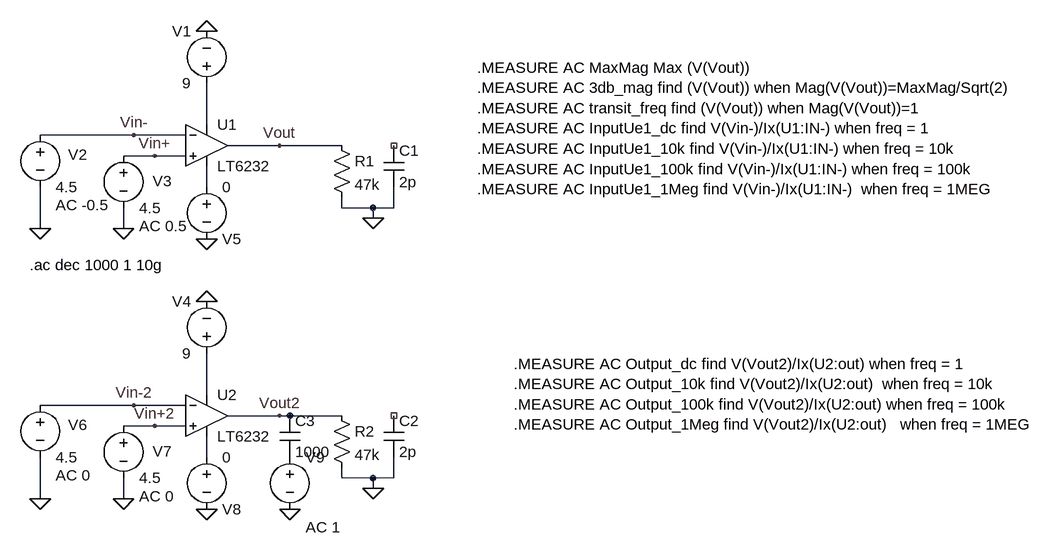
[diagram p0: schematic OpAmpTestBench.asc]
OpAmpTestBench.asc, the LTspice schematic file:
Version 4
SHEET 1 1624 796
WIRE 208 160 208 96
WIRE 96 176 -48 176
WIRE 176 176 96 176
WIRE 320 192 240 192
WIRE 416 192 320 192
WIRE 128 208 80 208
WIRE 176 208 128 208
WIRE 208 256 208 224
WIRE 416 288 416 272
WIRE 464 288 416 288
WIRE 496 288 496 256
WIRE 496 288 464 288
WIRE 464 304 464 288
WIRE -48 320 -48 256
WIRE 80 320 80 288
WIRE 208 576 208 512
WIRE 96 592 -48 592
WIRE 176 592 96 592
WIRE 320 608 240 608
WIRE 336 608 320 608
WIRE 416 608 336 608
WIRE 128 624 80 624
WIRE 176 624 128 624
WIRE 208 672 208 640
WIRE 416 704 416 688
WIRE 464 704 416 704
WIRE 496 704 496 672
WIRE 496 704 464 704
WIRE 464 720 464 704
WIRE -48 736 -48 672
WIRE 80 736 80 704
FLAG 208 16 0
FLAG 464 304 0
FLAG 80 320 0
FLAG -48 320 0
FLAG 96 176 Vin-
FLAG 128 208 Vin+
FLAG 320 192 Vout
FLAG 208 336 0
FLAG 208 432 0
FLAG 464 720 0
FLAG 80 736 0
FLAG -48 736 0
FLAG 96 592 Vin-2
FLAG 128 624 Vin+2
FLAG 320 608 Vout2
FLAG 208 752 0
FLAG 336 752 0
SYMBOL Opamps\\LT6232 208 192 R0
SYMATTR InstName U1
SYMBOL voltage 208 112 R180
WINDOW 0 24 96 Left 2
WINDOW 3 24 16 Left 2
WINDOW 123 0 0 Left 2
WINDOW 39 0 0 Left 2
SYMATTR InstName V1
SYMATTR Value 9
SYMBOL res 400 176 R0
SYMATTR InstName R1
SYMATTR Value 47k
SYMBOL cap 480 192 R0
SYMATTR InstName C1
SYMATTR Value 2p
SYMBOL voltage -48 160 R0
WINDOW 0 43 46 Left 2
WINDOW 123 24 124 Left 2
WINDOW 39 24 152 Left 2
SYMATTR InstName V2
SYMATTR Value2 AC -0.5
SYMATTR Value 4.5
SYMBOL voltage 80 192 R0
WINDOW 0 45 55 Left 2
WINDOW 123 24 124 Left 2
WINDOW 39 24 152 Left 2
SYMATTR InstName V3
SYMATTR Value2 AC 0.5
SYMATTR Value 4.5
SYMBOL voltage 208 240 R0
WINDOW 0 24 96 Left 2
WINDOW 3 24 16 Left 2
WINDOW 123 0 0 Left 2
WINDOW 39 0 0 Left 2
SYMATTR InstName V5
SYMATTR Value 0
SYMBOL Opamps\\LT6232 208 608 R0
SYMATTR InstName U2
SYMBOL voltage 208 528 R180
WINDOW 0 24 96 Left 2
WINDOW 3 24 16 Left 2
WINDOW 123 0 0 Left 2
WINDOW 39 0 0 Left 2
SYMATTR InstName V4
SYMATTR Value 9
SYMBOL res 400 592 R0
SYMATTR InstName R2
SYMATTR Value 47k
SYMBOL cap 480 608 R0
SYMATTR InstName C2
SYMATTR Value 2p
SYMBOL voltage -48 576 R0
WINDOW 0 43 46 Left 2
WINDOW 123 24 124 Left 2
WINDOW 39 24 152 Left 2
SYMATTR InstName V6
SYMATTR Value2 AC 0
SYMATTR Value 4.5
SYMBOL voltage 80 608 R0
WINDOW 0 45 55 Left 2
WINDOW 123 24 124 Left 2
WINDOW 39 24 152 Left 2
SYMATTR InstName V7
SYMATTR Value2 AC 0
SYMATTR Value 4.5
SYMBOL voltage 208 656 R0
WINDOW 0 24 96 Left 2
WINDOW 3 24 16 Left 2
WINDOW 123 0 0 Left 2
WINDOW 39 0 0 Left 2
SYMATTR InstName V8
SYMATTR Value 0
SYMBOL voltage 336 656 R0
WINDOW 123 24 124 Left 2
WINDOW 39 0 0 Left 2
SYMATTR InstName V9
SYMATTR Value ""
SYMATTR Value2 AC 1
SYMBOL cap 320 608 R0
SYMATTR InstName C3
SYMATTR Value 1000
TEXT -64 376 Left 2 !.ac dec 1000 1 10g
TEXT 624 72 Left 2 !.MEASURE AC MaxMag Max (V(Vout))\n.MEASURE AC 3db_mag find (V(Vout)) when Mag(V(Vout))=MaxMag/Sqrt(2)\n.MEASURE AC transit_freq find (V(Vout)) when Mag(V(Vout))=1\n.MEASURE AC InputUe1_dc find V(Vin-)/Ix(U1:IN-) when freq = 1\n.MEASURE AC InputUe1_10k find V(Vin-)/Ix(U1:IN-) when freq = 10k\n.MEASURE AC InputUe1_100k find V(Vin-)/Ix(U1:IN-) when freq = 100k\n.MEASURE AC InputUe1_1Meg find V(Vin-)/Ix(U1:IN-)  when freq = 1MEG
TEXT 680 528 Left 2 !.MEASURE AC Output_dc find V(Vout2)/Ix(U2:out) when freq = 1\n.MEASURE AC Output_10k find V(Vout2)/Ix(U2:out)  when freq = 10k\n.MEASURE AC Output_100k find V(Vout2)/Ix(U2:out) when freq = 100k\n.MEASURE AC Output_1Meg find V(Vout2)/Ix(U2:out)   when freq = 1MEG

The netlist it stands for:
* OpAmpTestBench.asc
* U1: LT6232 (symbol Opamps\LT6232 not available, pins judged from their places): In+=Vin+ In-=Vin- V+=N001 V-=N002 OUT=Vout
V1 N001 0 9
R1 Vout 0 47k
C1 NC_01 0 2p
V2 Vin- 0 4.5 AC -0.5
V3 Vin+ 0 4.5 AC 0.5
V5 N002 0 0
* U2: LT6232 (symbol Opamps\LT6232 not available, pins judged from their places): In+=Vin+2 In-=Vin-2 V+=N003 V-=N004 OUT=Vout2
V4 N003 0 9
R2 Vout2 0 47k
C2 NC_02 0 2p
V6 Vin-2 0 4.5 AC 0
V7 Vin+2 0 4.5 AC 0
V8 N004 0 0
V9 P001 0 AC 1
C3 Vout2 P001 1000
.ac dec 1000 1 10g
.MEASURE AC MaxMag Max (V(Vout))
.MEASURE AC 3db_mag find (V(Vout)) when Mag(V(Vout))=MaxMag/Sqrt(2)
.MEASURE AC transit_freq find (V(Vout)) when Mag(V(Vout))=1
.MEASURE AC InputUe1_dc find V(Vin-)/Ix(U1:IN-) when freq = 1
.MEASURE AC InputUe1_10k find V(Vin-)/Ix(U1:IN-) when freq = 10k
.MEASURE AC InputUe1_100k find V(Vin-)/Ix(U1:IN-) when freq = 100k
.MEASURE AC InputUe1_1Meg find V(Vin-)/Ix(U1:IN-)  when freq = 1MEG
.MEASURE AC Output_dc find V(Vout2)/Ix(U2:out) when freq = 1
.MEASURE AC Output_10k find V(Vout2)/Ix(U2:out)  when freq = 10k
.MEASURE AC Output_100k find V(Vout2)/Ix(U2:out) when freq = 100k
.MEASURE AC Output_1Meg find V(Vout2)/Ix(U2:out)   when freq = 1MEG
.backanno
.end